# EAGLE schematic H-Bridge Motor Control v01 (EAGLE 7.3.0)
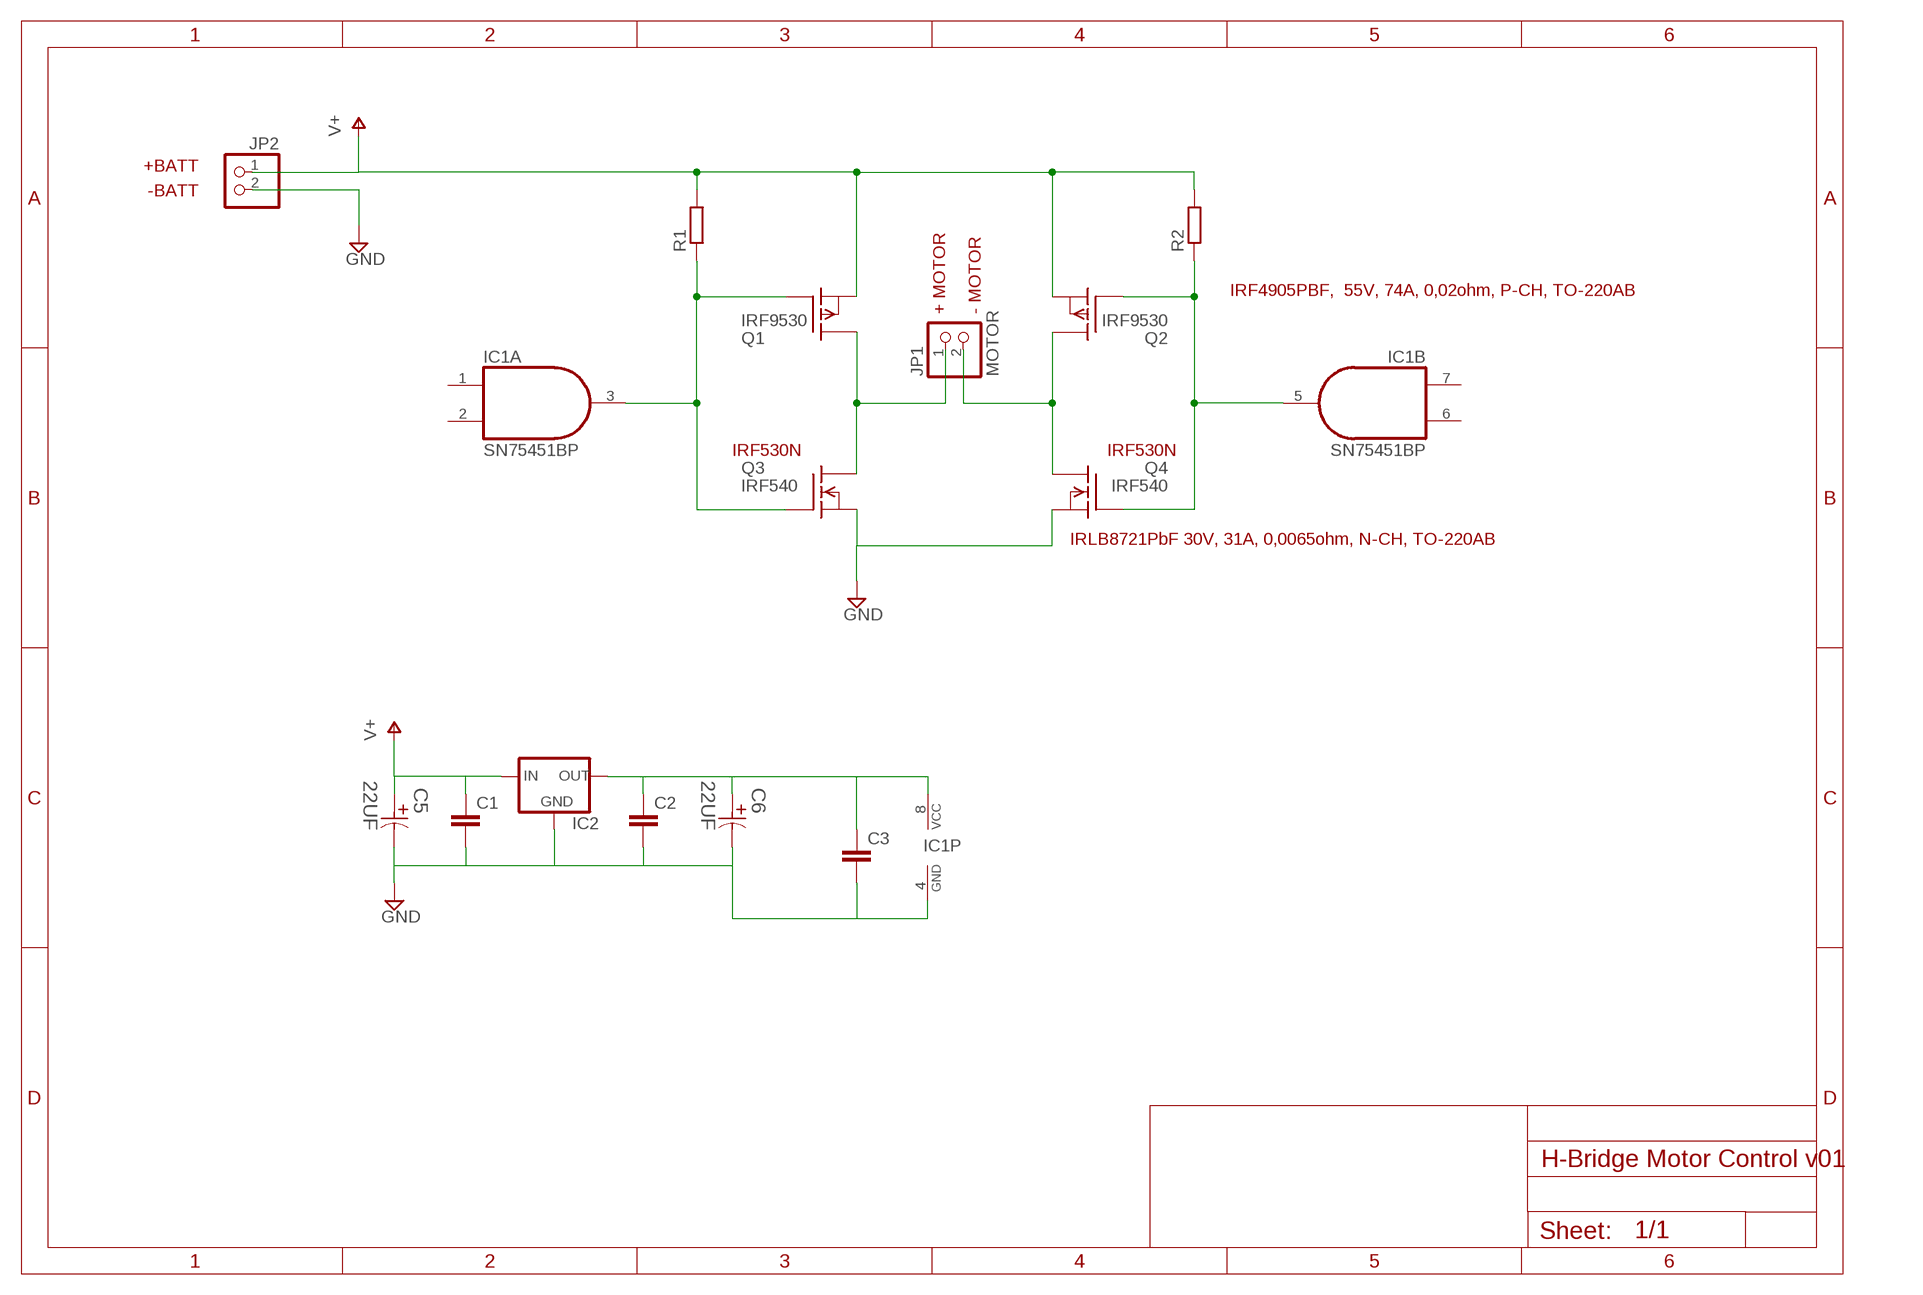
[diagram p0: schematic, sheet 1]

## Parts
C1  C5/5  [C5B5]
C2  C5/5  [C5B5]
C3  C5/5  [C5B5]
C5  22UF  ECA1EAK220X-D5XP2  [CAPPR200-500X1100]
C6  22UF  ECA1EAK220X-D5XP2  [CAPPR200-500X1100]
IC1  SN75451BP  [DIL08]
IC2  78XXL  [78XXL]
JP1  MOTOR  PINHD-1X2  [1X02]
JP2  PINHD-1X2  [1X02]
Q1  IRF9530  [TO220]
Q2  IRF9530  [TO220]
Q3  IRF540  [TO220]
Q4  IRF540  [TO220]
R1  R-EU_0207/10  [0207/10]
R2  R-EU_0207/10  [0207/10]

## Nets
GND: C1.2 C2.2 C3.2 C5.2 C6.2 IC1.4(P:GND) IC2.GND JP2.2 Q3.3(S) Q4.3(S)
N$1: IC1.3(A:O) Q1.1(G) Q3.1(G) R1.1
N$2: IC1.5(B:O) Q2.1(G) Q4.1(G) R2.1
N$3: JP1.1 Q1.2(D) Q3.2(D)
N$4: JP1.2 Q2.2(D) Q4.2(D)
N$5: C2.1 C3.1 C6.1 IC1.8(P:VCC) IC2.OUT
V+: C1.1 C5.1 IC2.IN JP2.1 Q1.3(S) Q2.3(S) R1.2 R2.2
Unconnected: IC1.1(A:I0) IC1.2(A:I1) IC1.6(B:I1) IC1.7(B:I0)

## Notes on the sheet
- +BATT
- -BATT
- IRF4905PBF,  55V, 74A, 0,02ohm, P-CH, TO-220AB
- + MOTOR | - MOTOR
- IRF530N | IRF530N
- IRLB8721PbF 30V, 31A, 0,0065ohm, N-CH, TO-220AB

## Library data of the parts
C1-C3 = capacitor-wima:C: CAPACITOR naming: grid - package width
C5 C6 = Panasonic-ECA_01:ECA: Aluminum Electrolytic Capacitors/Radial Lead Type; MPN: ECA1EAK220X; OC_FARNELL: 8766762; OC_NEWARK: 38K1157; PACKAGE: Radial Lead-TH; SUPPLIER: PANASONIC; TOLERANCE: ±20 %; VOLTAGERATING: 25V
IC1 = texas-sn55-sn75:SN75451B: AND PERIPHERAL DRIVERS FOR HIGH-CURRENT SWITCHING AT VERY HIGH SPEEDS Source: www.ti.com sn75452b.pdf
IC2 = v-reg:78XXL: VOLTAGE REGULATOR
JP1 JP2 = pinhead:PINHD-1X2: PIN HEADER
Q1 Q2 = transistor-fet:IRF9530: P-Channel Enhancement MOSFET (HEXFET); -100V; -12A; 0,3Ohm
Q3 Q4 = transistor-fet:IRF540: N-Channel Enhancement MOSFET (HEXFET); 100V; 28A; 0,077Ohm
R1 R2 = resistor:R-EU_: RESISTOR, European symbol